# Altium project Nguon_MIC.PrjPcb
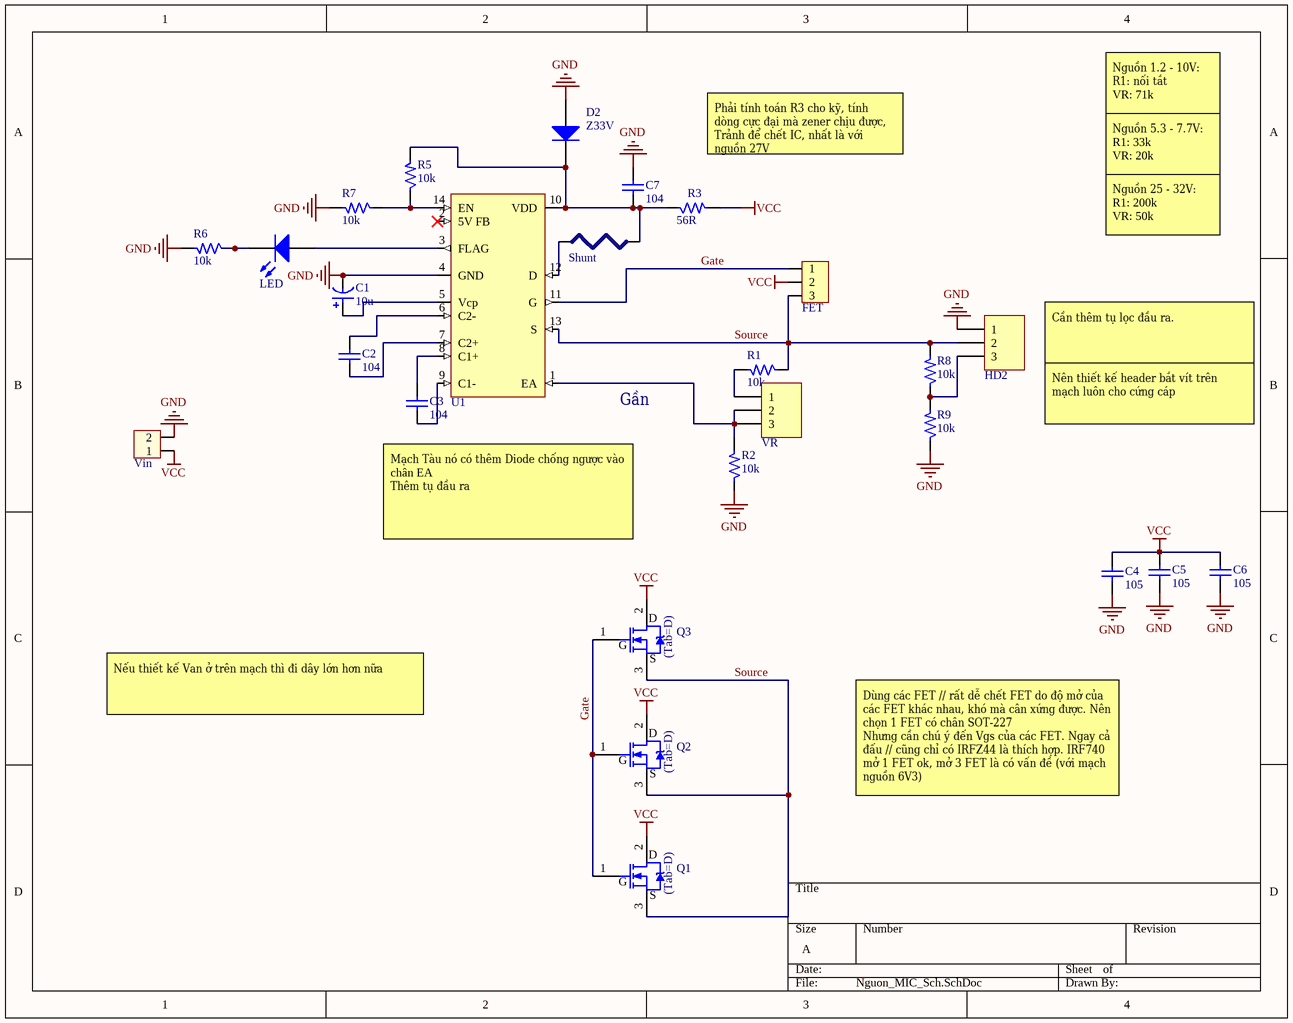
[diagram p0: Nguon_MIC_Sch.SchDoc]
1 sheet, 26 parts. Net scope: global (net labels, ports and power ports of the same name join across sheets).
Board file: Nguon_MIC_PCB.PcbDoc

## Sheet Nguon_MIC_Sch.SchDoc
size A

### Parts
C1  value 10u  [C5mm]  (hidden comment: Cap Pol1)
C2  value 104  [CN1.5]  (hidden comment: Cap)
C3  value 104  [CN1.5]  (hidden comment: Cap)
C4  value 105  [CN1.5]  (hidden comment: Cap)
C5  value 105  [CN1.5]  (hidden comment: Cap)
C6  value 105  [CN1.5]  (hidden comment: Cap)
C7  value 104  [CN1.5]  (hidden comment: Cap)
D2  Z33V  [1N4148]
FET  Header 3  [Header 3 - 150mil]  (value not drawn)
HD2  Header 3  [BIG_Header 3]  (value not drawn)
LED  LED SMD  [LED_0805_Blue]  (value not drawn)
Q1  IRF3205  [TO-220]  (value not drawn)
Q2  IRF3205  [TO-220]  (value not drawn)
Q3  IRF3205  [TO-220]  (value not drawn)
R1  10k  [SM-0805]
R2  10k  [SM-0805]
R3  56R  [R2W]
R5  10k  [SM-0805]
R6  10k  [SM-0805]
R7  10k  [SM-0805]
R8  10k  [SM-0805]
R9  10k  [SM-0805]
Shunt  Shunt  [Shunt 5mR]  (value not drawn)
U1  MIC5158  [SOIC14]  (value not drawn)
Vin  Header 2  [HEAD2T]  (value not drawn)
VR  Header 3  [BIG_Header 3]  (value not drawn)

### Nets
GND: C1.2 C4.1 C5.1 C6.1 C7.2 D2.1(A) HD2.1 R2.1 R6.2 R7.2 R9.1 U1.4(GND) Vin.2
VCC: C4.2 C5.2 C6.2 FET.2 Q1.2(D) Q2.2(D) Q3.2(D) R3.2 Vin.1
Gate: FET.1 Q1.1(G) Q2.1(G) Q3.1(G) U1.11(G)
Source: FET.3 HD2.2 Q1.3(S) Q2.3(S) Q3.3(S) R1.1 R8.2 U1.13(S)
NetC1_1: C1.1 U1.5(Vcp)
NetC2_1: C2.1 U1.7(C2+)
NetC2_2: C2.2 U1.6(C2-)
NetC3_1: C3.1 U1.9(C1-)
NetC3_2: C3.2 U1.8(C1+)
NetC7_1: C7.1 D2.2(K) R3.1 R5.2 Shunt.1 U1.10(VDD)
NetHD2_3: HD2.3 R8.1 R9.2
NetLED_1: LED.1(A) U1.3(FLAG)
NetLED_2: LED.2(K) R6.1
NetR1_2: R1.2 VR.1
NetR2_2: R2.2 U1.1(EA) VR.2 VR.3
NetR5_1: R5.1 R7.1 U1.14(EN)
NetShunt_2: Shunt.2 U1.12(D)

Not connected (* = marked no-connect by the designer): U1 2(5V_FB)*

### Notes on the sheet
- Phải tính toán R3 cho kỹ, tính dòng cực đại mà zener chịu được, Trảnh để chết IC, nhất là với nguồn 27V
- Nguồn 1.2 - 10V:
  R1: nối tắt
  VR: 71k
- Nguồn 25 - 32V:
  R1: 200k
  VR: 50k
- Nguồn 5.3 - 7.7V:
  R1: 33k
  VR: 20k
- Cần thêm tụ lọc đầu ra.
- Gần
- Nên thiết kế header bắt vít trên mạch luôn cho cứng cáp
- (near C3) Mạch Tàu nó có thêm Diode chống ngược vào chân EA
  Thêm tụ đầu ra
- Nếu thiết kế Van ở trên mạch thì đi dây lớn hơn nữa
- Dùng các FET // rất dễ chết FET do độ mở của các FET khác nhau, khó mà cân xứng được. Nên chọn 1 FET có chân SOT-227
  Nhưng cần chú ý đến Vgs của các FET. Ngay cả đấu // cũng chỉ có IRFZ44 là thích hợp. IRF740 mở 1 FET ok, mở 3 FET là có vấn đề (với mạch nguồn 6V3)
- (in symbol IRF3205) (Tab=D)

### Library data of the parts
C1 = Cap Pol: Published: 8-Jun-2000; LatestRevisionDate: 17-Jul-2002; LatestRevisionNote: Re-released for DXP Platform.; PackageReference: RB7.6-15; Publisher: Altium Limited; PackageDescription: Polarized Capacitor (Radial); 2 Leads
C2-C7 = Cap: Capacitor; Published: 8-Jun-2000; LatestRevisionDate: 17-Jul-2002; LatestRevisionNote: Re-released for DXP Platform.; PackageReference: RAD-0.3; Publisher: Altium Limited; PackageDescription: Radial Cap, Thru-Hole; 2 Leads; 0.3 in Pin Spacing
D2 = Diode: Default Diode; Published: 8-Jun-2000; LatestRevisionDate: 17-Jul-2002; LatestRevisionNote: Re-released for DXP Platform.; PackageVersion: Sep-1996; PackageReference: SMC; Publisher: Altium Limited; PackageDescription: DO-214-AB/SMC; 2 C-Bend Leads; Body 7.9 x 5.9 mm, inc. leads (LxW); Code_JEDEC: DO-214-AB
HD2 VR = Header 3: Header, 3-Pin; LatestRevisionDate: 17-Jul-2002; LatestRevisionNote: Re-released for DXP Platform.; Publisher: Altium Limited
LED = LED SMD: LED
Q1-Q3 = IRF3205: HEXFET N-Channel Power MOSFET
R1 R2 R5-R9 = RES 0805: RES SMD 10K OHM 5% 1/8W 0805; Manufacturer: Stackpole Electronics Inc.; Manufacturer Part Number: RMCF0805JT10K0; Power (Watts): 0.125W, 1/8W; Temperature Coefficient: ±200ppm/°C; Supplier 1: Digi-Key; RoHS: RoHS Compliant; Category: Resistors; Stock 1: 965000; Pricing 1: 5000=0.0019, 10000=0.00165, 25000=0.00145, 50000=0.00133, 125000=0.0013 (USD); Packaging: Tape & Reel (TR); Tolerance: ±5%; Composition: Thick Film; Features: Automotive AEC-Q200; Operating Temperature: -55°C ~ 155°C; Package / Case: 0805 (2012 Metric); Supplier Device Package: 0805; Size / Dimension: 0.079" L x 0.049" W (2.00mm x 1.25mm); Height: 0.026" (0.65mm); Number of Terminations: 2; ComponentLink1URL: http://www.seielect.com/Catalog/SEI-RMCF_RMCP.pdf; ComponentLink1Description: http://www.seielect.com/Catalog/SEI-RMCF_RMCP.pdf; Supplier Part Number 1: RMCF0805JT10K0TR-ND; Resistance (Ohms): 10k
R3 = RES DIP: RES DIP 10K OHM 5% 1/4W; Manufacturer: Stackpole Electronics Inc.; Manufacturer Part Number: RMCF0805JT10K0; Power (Watts): 0.125W, 1/8W; Temperature Coefficient: ±200ppm/°C; RoHS: RoHS Compliant; Category: Resistors; Packaging: Tape & Reel (TR); Tolerance: ±5%; Composition: Thick Film; Features: Automotive AEC-Q200; Operating Temperature: -55°C ~ 155°C; Package / Case: 0805 (2012 Metric); Supplier Device Package: 0805; Size / Dimension: 0.079" L x 0.049" W (2.00mm x 1.25mm); Height: 0.026" (0.65mm); Number of Terminations: 2; ComponentLink1URL: http://www.seielect.com/Catalog/SEI-RMCF_RMCP.pdf; ComponentLink1Description: http://www.seielect.com/Catalog/SEI-RMCF_RMCP.pdf; Resistance (Ohms): 56R
U1 = MIC5158: Super LDO
Vin = Header 2: Header, 2-Pin; Value: Header 2